# Altium project BlinkLight.PrjPCB
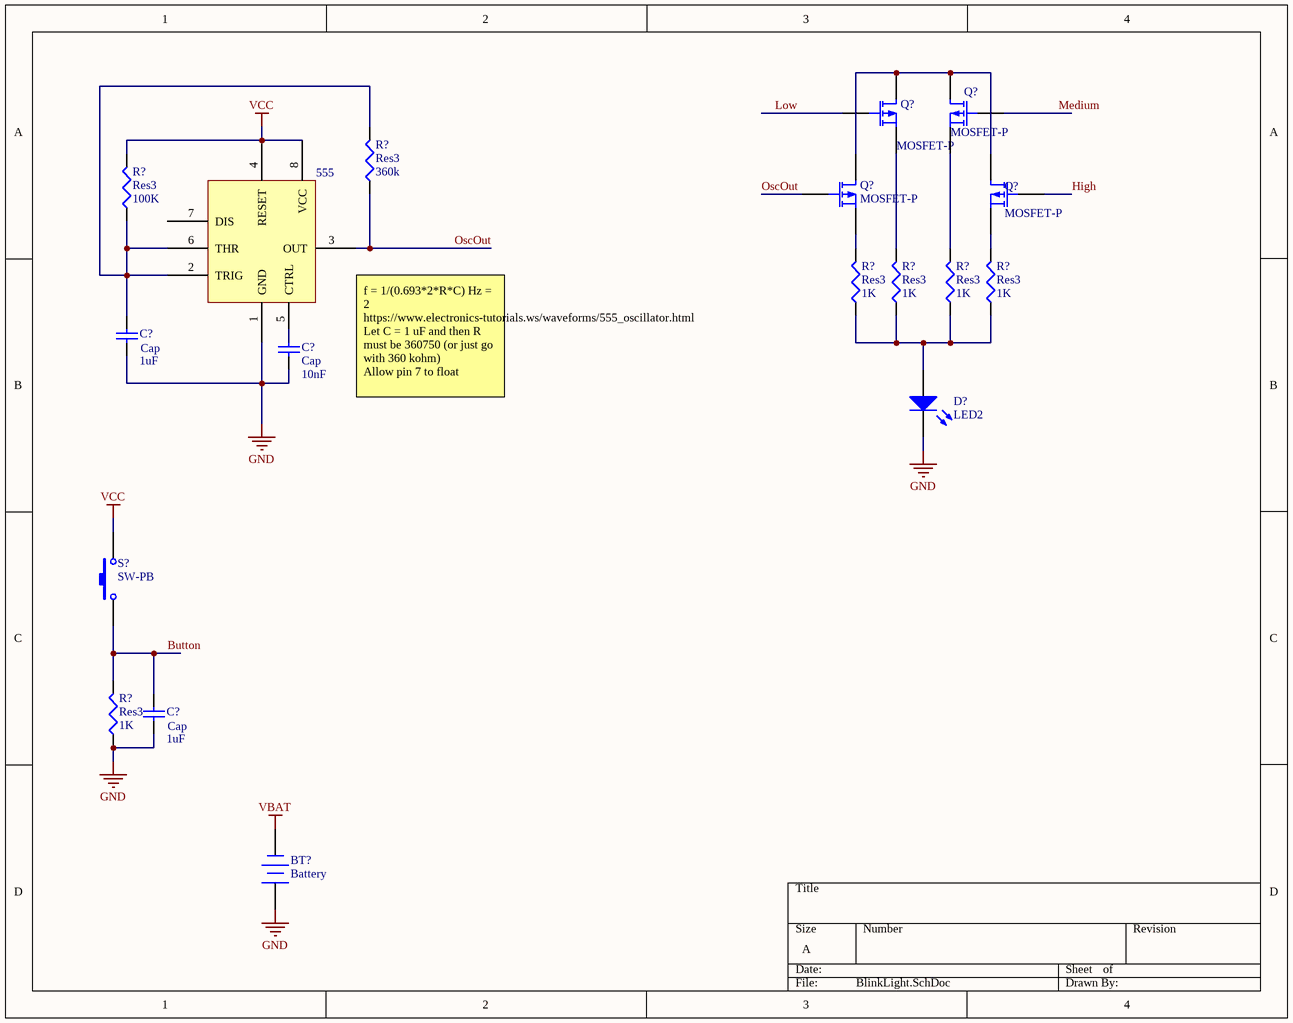
[diagram p0: BlinkLight.SchDoc]
1 sheet, 18 parts. Net scope: global (net labels, ports and power ports of the same name join across sheets).
Board file: BlinkLight.PcbDoc

## Sheet BlinkLight.SchDoc
size A

### Parts
(Parts that share a designator on the sheet are numbered #1, #2 ... from top to bottom, then left to right.)
?  555
BT?  Battery  [BAT-2]
C?#1  Cap  value 1uF  [RAD-0.3]
C?#2  Cap  value 10nF  [RAD-0.3]
C?#3  Cap  value 1uF  [RAD-0.3]
D?  LED2  [3.2X1.6X1.1]
Q?#1  MOSFET-P  [E3]
Q?#2  MOSFET-P  [E3]
Q?#3  MOSFET-P  [E3]
Q?#4  MOSFET-P  [E3]
R?#1  Res3  value 360k  [J1-0603]
R?#2  Res3  value 100K  [J1-0603]
R?#3  Res3  value 1K  [J1-0603]
R?#4  Res3  value 1K  [J1-0603]
R?#5  Res3  value 1K  [J1-0603]
R?#6  Res3  value 1K  [J1-0603]
R?#7  Res3  value 1K  [J1-0603]
S?  SW-PB  [SPST-2]

### Nets
GND: ?.1(GND) BT?.1(+) C?#1.1 C?#2.1 C?#3.1 D?.2(K) R?#7.1
VBAT: BT?.2(-)
VCC: ?.4(RESET) ?.8(VCC) R?#2.2 S?.2
Button: C?#3.2 R?#7.2 S?.1
High: Q?#4.2(G)
Low: Q?#1.2(G)
Medium: Q?#2.2(G)
OscOut: ?.3(OUT) Q?#3.2(G) R?#1.1
Net?_2: ?.2(TRIG) ?.6(THR) C?#1.2 R?#1.2 R?#2.1
Net?_5: ?.5(CTRL) C?#2.2
NetD?_1: D?.1(A) R?#3.1 R?#4.1 R?#5.1 R?#6.1
NetQ?#1_1: Q?#1.1(D) Q?#2.1(D) Q?#3.1(D) Q?#4.1(D)
NetQ?#1_3: Q?#1.3(S) R?#4.2
NetQ?#2_3: Q?#2.3(S) R?#5.2
NetQ?#3_3: Q?#3.3(S) R?#3.2
NetQ?#4_3: Q?#4.3(S) R?#6.2

Not connected (* = marked no-connect by the designer): ? 7(DIS)

### Notes on the sheet
- f = 1/(0.693*2*R*C) Hz = 2
  https://www.electronics-tutorials.ws/waveforms/555_oscillator.html
  Let C = 1 uF and then R must be 360750 (or just go with 360 kohm)
  Allow pin 7 to float

### Library data of the parts
BT? = Battery: Multicell Battery; Published: 24-Mar-1999; LatestRevisionDate: 17-Jul-2002; LatestRevisionNote: Re-released for DXP Platform.; PackageReference: BAT-2; Publisher: Altium Limited; PackageDescription: Battery; 2 Leads
C?#1-C?#3 = Cap: Capacitor; Published: 8-Jun-2000; LatestRevisionDate: 17-Jul-2002; LatestRevisionNote: Re-released for DXP Platform.; PackageReference: RAD-0.3; Publisher: Altium Limited; PackageDescription: Radial Cap, Thru-Hole; 2 Leads; 0.3 in Pin Spacing
D? = LED2: Typical RED, GREEN, YELLOW, AMBER GaAs LED; Published: 8-Jun-2000; LatestRevisionDate: 17-Jul-2002; LatestRevisionNote: Re-released for DXP Platform.; PackageVersion: Feb-2002; PackageReference: 3.2X1.6X1.1; Publisher: Altium Limited; PackageDescription: SM LED; 2 Flat Leads
Q?#1-Q?#4 = MOSFET-P: P-Channel MOSFET; Published: 8-Jun-2000; LatestRevisionDate: 17-Jul-2002; LatestRevisionNote: Re-released for DXP Platform.; PackageVersion: 1995/1996; PackageReference: E3; Publisher: Altium Limited; PackageDescription: TO, Flat Index; 3 In-Line, Axial Leads; Body Dia. 4.6mm; Lead Dia. 0.5 mm (max)
R?#1-R?#7 = Res3: Resistor; Published: 8-Jun-2000; LatestRevisionDate: 29-May-2009; LatestRevisionNote: IPC-7351 Footprint Added.; PackageReference: J1-0603; Publisher: Altium Limited; PackageDescription: Chip Resistor
S? = SW-PB: Switch; Published: 24-Mar-1999; LatestRevisionDate: 17-Jul-2002; LatestRevisionNote: Re-released for DXP Platform.; PackageReference: SPST-2; Publisher: Altium Limited; PackageDescription: Switch; 2 Leads